# EAGLE schematic 1DQ542MA GRBL (EAGLE 8.4.3)
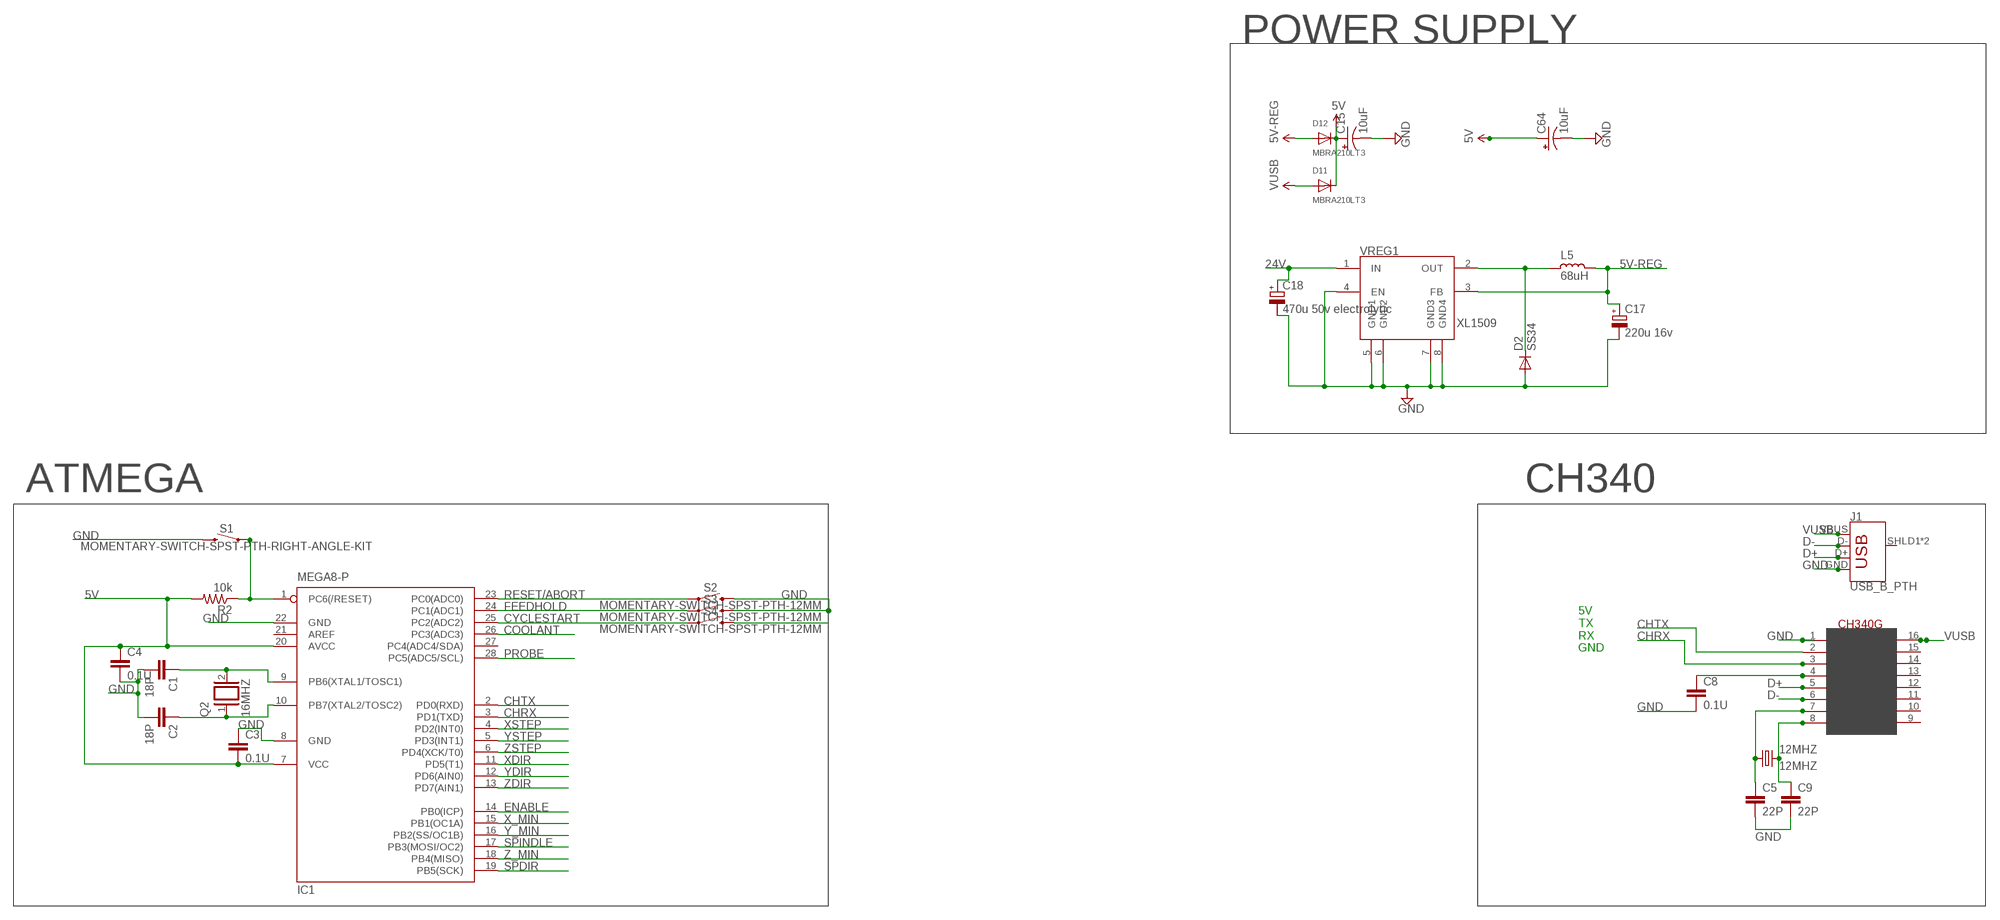
[diagram p0: schematic, sheet 1]

## Parts
12MHZ  12MHZ  CRYSTALHC49U70  [HC49U70]
C1  18P  C-EUC1206  [C1206]
C2  18P  C-EUC1206  [C1206]
C3  0.1U  C-EUC1206  [C1206]
C4  0.1U  C-EUC1206  [C1206]
C5  22P  C-EUC1206  [C1206]
C8  0.1U  C-EUC1206  [C1206]
C9  22P  C-EUC1206  [C1206]
C15  10uF  CAP_POL1206  [EIA3216]
C17  220u 16v  CPOL-EUE  [PANASONIC_E]
C18  470u 50v electrolytic  CPOL-EUG  [PANASONIC_G]
C64  10uF  CAP_POL1206  [EIA3216]
D2  SS34  DIODE-DO-214AC  [DO-214AC]
D11  MBRA210LT3  DIODESMA  [SMADIODE]
D12  MBRA210LT3  DIODESMA  [SMADIODE]
IC1  MEGA8-P  [DIL28-3]
J1  USB_B_PTH  [USB-B-PTH]
L5  68uH  L_CD75  [CD75]
Q2  16MHZ  XTAL/S  [QS]
R2  10k  R-US_R1206  [R1206]
S1  MOMENTARY-SWITCH-SPST-PTH-RIGHT-ANGLE-KIT  [TACTILE_SWITCH_PTH_RIGHT_ANGLE_KIT]
S2  MOMENTARY-SWITCH-SPST-PTH-12MM  [TACTILE_SWITCH_PTH_12MM]
S3  MOMENTARY-SWITCH-SPST-PTH-12MM  [TACTILE_SWITCH_PTH_12MM]
S4  MOMENTARY-SWITCH-SPST-PTH-12MM  [TACTILE_SWITCH_PTH_12MM]
U$2  CH340G  [SOIC16]
VREG1  XL1509  [SO08]

## Nets
5V: C3.2 C4.1 C15.A(+) C64.A(+) D11.C D12.C IC1.7(VCC) IC1.20(AVCC) R2.2
5V-REG: C17.+ D12.A L5.1 VREG1.3(FB)
24V: C18.+ VREG1.1(IN)
CHRX: IC1.3(PD1(TXD)) U$2.3(RX)
CHTX: IC1.2(PD0(RXD)) U$2.2(TX)
COOLANT: IC1.26(PC3(ADC3))
CYCLESTART: IC1.25(PC2(ADC2)) S4.1
D+: J1.D+ U$2.5(D+)
D-: J1.D- U$2.6(D-)
ENABLE: IC1.14(PB0(ICP))
FEEDHOLD: IC1.24(PC1(ADC1)) S3.1
GND: C1.2 C2.2 C3.1 C4.2 C5.2 C8.2 C9.2 C15.C(-) C17.- C18.- C64.C(-) D2.2(A) IC1.8(GND) IC1.22(GND) J1.GND S1.2 S2.3 S3.3 S4.3 U$2.1(GND) VREG1.4(EN) VREG1.5(GND1) VREG1.6(GND2) VREG1.7(GND3) VREG1.8(GND4)
N$3: C1.1 IC1.9(PB6(XTAL1/TOSC1)) Q2.2
N$5: C2.1 IC1.10(PB7(XTAL2/TOSC2)) Q2.1
N$9: 12MHZ.1 C5.1 U$2.7(XI)
N$11: 12MHZ.2 C9.1 U$2.8(XO)
N$12: C8.1 U$2.4(V3)
N$292: D2.1(C) L5.2 VREG1.2(OUT)
PROBE: IC1.28(PC5(ADC5/SCL))
RESET: IC1.1(PC6(/RESET)) R2.1 S1.1
RESET/ABORT: IC1.23(PC0(ADC0)) S2.1
SPDIR: IC1.19(PB5(SCK))
SPINDLE: IC1.17(PB3(MOSI/OC2))
VUSB: D11.A J1.VBUS U$2.16(VCC)
X_MIN: IC1.15(PB1(OC1A))
XDIR: IC1.11(PD5(T1))
XSTEP: IC1.4(PD2(INT0))
Y_MIN: IC1.16(PB2(SS/OC1B))
YDIR: IC1.12(PD6(AIN0))
YSTEP: IC1.5(PD3(INT1))
Z_MIN: IC1.18(PB4(MISO))
ZDIR: IC1.13(PD7(AIN1))
ZSTEP: IC1.6(PD4(XCK/T0))
Unconnected: IC1.21(AREF) IC1.27(PC4(ADC4/SDA)) J1.SHLD1(SHIELD) J1.SHLD2(SHIELD) U$2.9(CTS) U$2.10(DSR) U$2.11(RI) U$2.12(DCD) U$2.13(DTR) U$2.14(RTS) U$2.15(RS232)

## Notes on the sheet
- POWER SUPPLY
- ATMEGA | CH340
- 5V
  TX
  RX
  GND

## Library data of the parts
12MHZ = crystal:CRYSTAL: CRYSTAL; OC_FARNELL: unknown; OC_NEWARK: unknown
C1-C5 C8 C9 = rcl:C-EU: CAPACITOR, European symbol
C15 C64 = SparkFun:CAP_POL: Capacitor Polarized These are standard SMD and PTH capacitors. Normally 10uF, 47uF, and 100uF in electrolytic and tantalum varieties. Always verify the external diameter of the through hole cap, it varies with capacity, voltage, and manufacturer. The EIA devices should be standard.
C17 C18 = rcl:CPOL-EU: POLARIZED CAPACITOR, European symbol
D2 = dp_devices:DIODE: Various Diode Packages
D11 D12 = microbuilder:DIODE: Diode SMADIODE - SMA Surface Mount Package 20V 1A Schottky Diode Digikey (500mV @ 1A, 500uA Vr @ 20V): 641-1014-6-ND 10V 2A Schottky Diode Digikey (350mV @ 2A, 700uA Vr @ 10V): MBRA210LT3 SOD-123 30V 200mA (800mV Vf, 2uA Vr @ 25V) Schottky Diode (very fast switching for boost, etc.) - Digikey: BAT54T1GOSTR-ND 30V 500mA (430mV Vf, 130uA Vr @ 30V) Schottky Diode - Digikey: B0530W-FDICT-ND MBR120 1A 20V (0.34Vf) Schottky Diode - Digikey: MBR120VLSFT1GOSCT-ND SOD-323 10V 570mA (380mV Vf, 3ns) Schottky Diode - Digikey: ZLLS410CT-ND 1N4148WS - 75V 150mA (1V Vf @ 10mA, 4ns) Simple Diode - Digikey: 1N4148WSFSCT-ND, Mouser: 512-1N4148WS SOD-523 BAT54 30V 200mA Schottky (0.8 Vf @ 100mA, 5ns) - Digikey: BAT54XV2CT-ND 30V 30mA Schottky Diode (RB751S-40TE61) - Digikey: RB751S-40TE61CT-ND SOT23-R/W - SOT23 Package (R = Solder Paste/Reflow Ovens, W = Hand-Soldering) BAT54Film 40V 300mA - Digikey: 497-7162-1-ND DO-1N4148 Through Hole Small Current Diode (any model)
IC1 = atmel:MEGA8-P: MICROCONTROLLER 8 Kbytes FLASH, 1 kbytes SRAM, 512 bytes EEPROM, USART, 4-channel 10 bit ADC, 2-channel 8 bit ADC Pin compatible with Atmega48, ATMega88, ATMega168 Source: avr.lbr; OC_FARNELL: unknown; OC_NEWARK: unknown
J1 = SparkFun-Connectors:USB_B: USB Type B Connector SparkFun Products: SparkFun Stepoko <https://www.sparkfun.com/products/13899> PTH; PROD_ID: CONN-08278; SF_ID: PRT-00139
L5 = rc-master-smd:L_: INDUCTOR
Q2 = special:XTAL/S: CRYSTAL
R2 = resistor:R-US_: RESISTOR, American symbol
S1 = SparkFun-Switches:MOMENTARY-SWITCH-SPST: Momentary Switch (Pushbutton) - SPST Normally-open (NO) SPST momentary switches (buttons, pushbuttons). Variants PTH-12MM - 12mm square, through-hole Momentary Pushbutton Switch - 12mm Square <https://www.sparkfun.com/products/9190> (COM-09190) PTH-6.0MM, PTH-6.0MM-KIT - 6.0mm square, through-hole Mini Pushbutton Switch <https://www.sparkfun.com/products/97> (COM-00097) KIT package intended for soldering kit's - only one side of pads' copper is exposed. PTH-RIGHT-ANGLE-KIT - Right-angle, through-hole Right Angle Tactile Button <https://www.sparkfun.com/products/10791> - Used on SparkFun BigTime Watch Kit <https://www.sparkfun.com/products/11734> SMD-12MM - 12mm square, surface-mount Tactile Button - SMD (12mm) <https://www.sparkfun.com/products/12993> (COM-12993) Used on SparkFun PicoBoard <https://www.sparkfun.com/products/11888> SMD-4.5MM - 4.5mm Square Trackball Switch Used on SparkFun Blackberry Trackballer Breakout <https://www.sparkfun.com/products/13169> SMD-4.6MMX2.8MM - 4.60mm x 2.80mm, surface mount Used on SparkFun SAMD21 Mini Breakout <https://www.sparkfun.com/products/13664> SMD-5.2MM, SMD-5.2-REDUNDANT - 5.2mm square, surface-mount Mini Pushbutton Switch - SMD <https://www.sparkfun.com/products/8720> (COM-08720) Used on Arduino Pro Mini <https://www.sparkfun.com/products/11114> REDUNDANT package connects both switch circuits together SMD-6.0X3.5MM - 6.0 x 3.5mm, surface mount Momentary Reset Switch SMD <https://www.sparkfun.com/products/8229> (COM-08229) SMD-6.2MM-TALL - 6.2mm square, surface mount Tactile Button - SMD (6mm) <https://www.sparkfun.com/products/12992> Used on SparkFun Digital Sandbox <https://www.sparkfun.com/products/12651> SMD-RIGHT-ANGLE - Right-angle, surface mount Used on SparkFun Block for Intel® Edison - Arduino <https://www.sparkfun.com/products/13036>; PROD_ID: CONN-10672; SF_SKU: COM-10791
S2-S4 = SparkFun-Switches:MOMENTARY-SWITCH-SPST: Momentary Switch (Pushbutton) - SPST Normally-open (NO) SPST momentary switches (buttons, pushbuttons). Variants PTH-12MM - 12mm square, through-hole Momentary Pushbutton Switch - 12mm Square <https://www.sparkfun.com/products/9190> (COM-09190) PTH-6.0MM, PTH-6.0MM-KIT - 6.0mm square, through-hole Mini Pushbutton Switch <https://www.sparkfun.com/products/97> (COM-00097) KIT package intended for soldering kit's - only one side of pads' copper is exposed. PTH-RIGHT-ANGLE-KIT - Right-angle, through-hole Right Angle Tactile Button <https://www.sparkfun.com/products/10791> - Used on SparkFun BigTime Watch Kit <https://www.sparkfun.com/products/11734> SMD-12MM - 12mm square, surface-mount Tactile Button - SMD (12mm) <https://www.sparkfun.com/products/12993> (COM-12993) Used on SparkFun PicoBoard <https://www.sparkfun.com/products/11888> SMD-4.5MM - 4.5mm Square Trackball Switch Used on SparkFun Blackberry Trackballer Breakout <https://www.sparkfun.com/products/13169> SMD-4.6MMX2.8MM - 4.60mm x 2.80mm, surface mount Used on SparkFun SAMD21 Mini Breakout <https://www.sparkfun.com/products/13664> SMD-5.2MM, SMD-5.2-REDUNDANT - 5.2mm square, surface-mount Mini Pushbutton Switch - SMD <https://www.sparkfun.com/products/8720> (COM-08720) Used on Arduino Pro Mini <https://www.sparkfun.com/products/11114> REDUNDANT package connects both switch circuits together SMD-6.0X3.5MM - 6.0 x 3.5mm, surface mount Momentary Reset Switch SMD <https://www.sparkfun.com/products/8229> (COM-08229) SMD-6.2MM-TALL - 6.2mm square, surface mount Tactile Button - SMD (6mm) <https://www.sparkfun.com/products/12992> Used on SparkFun Digital Sandbox <https://www.sparkfun.com/products/12651> SMD-RIGHT-ANGLE - Right-angle, surface mount Used on SparkFun Block for Intel® Edison - Arduino <https://www.sparkfun.com/products/13036>; PROD_ID: SWCH-09185; SF_SKU: COM-09190
U$2 = usb-serial:CH340G
VREG1 = Cohesion_parts:XL1509

## Net classes
1 power: width 0.6 mm, clearance 0.305 mm
5 3.3-Amp Class: width 1.27 mm